# Altium schematic sheet Lesson_03.SchDoc
size A4
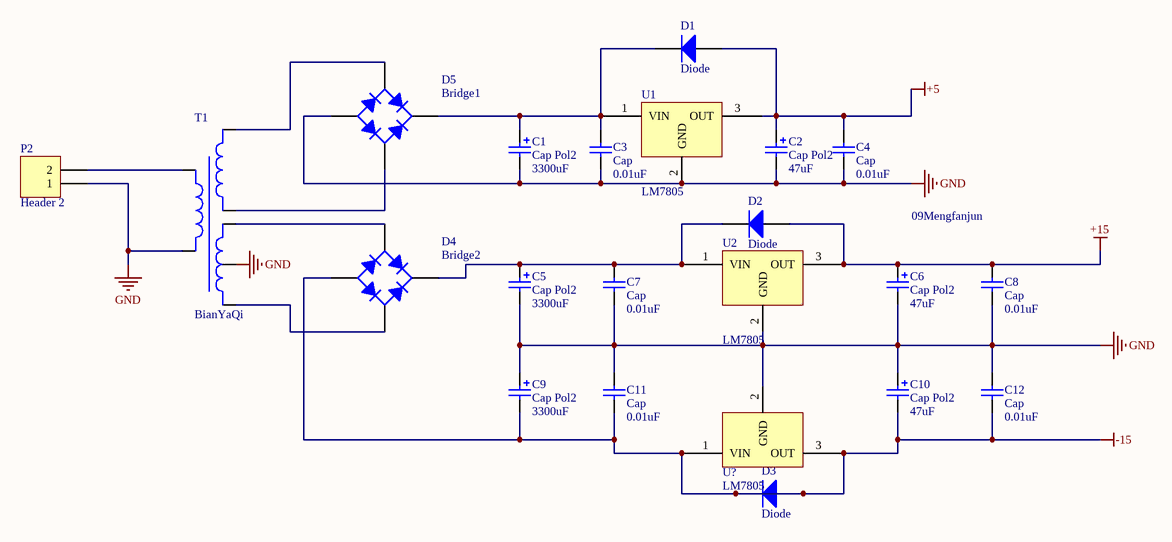
[diagram p0: Lesson_03.SchDoc]

## Parts
C1  Cap Pol2  value 3300uF  [POLAR0.8]
C2  Cap Pol2  value 47uF  [POLAR0.8]
C3  Cap  value 0.01uF  [RAD-0.3]
C4  Cap  value 0.01uF  [RAD-0.3]
C5  Cap Pol2  value 3300uF  [POLAR0.8]
C6  Cap Pol2  value 47uF  [POLAR0.8]
C7  Cap  value 0.01uF  [RAD-0.3]
C8  Cap  value 0.01uF  [RAD-0.3]
C9  Cap Pol2  value 3300uF  [POLAR0.8]
C10  Cap Pol2  value 47uF  [POLAR0.8]
C11  Cap  value 0.01uF  [RAD-0.3]
C12  Cap  value 0.01uF  [RAD-0.3]
D1  Diode  [SMC]
D2  Diode  [SMC]
D3  Diode  [SMC]
D4  Bridge2  [D-38]
D5  Bridge1  [D-38]
P2  Header 2  [HDR1X2]
T1  BianYaQi
U1  LM7805
U2  LM7805
U?  LM7805

## Nets
+5: C2.1 C4.2 D1.1(A) U1.3(OUT)
+15: C6.1 C8.2 D2.1(A) U2.3(OUT)
-15: C9.2 C10.2 C11.1 C12.1 D3.1(A) D3.2(K) D4.3(A) U?.1(VIN) U?.3(OUT)
GND: C1.2 C2.2 C3.1 C4.1 C5.2 C6.2 C7.1 C8.1 C9.1 C10.1 C11.2 C12.2 D5.3(A) P2.1 T1.2(Pri-) T1.6 U1.2(GND) U2.2(GND) U?.2(GND)
NetC1_1: C1.1 C3.2 D1.2(K) D5.1(K) U1.1(VIN)
NetC5_1: C5.1 C7.2 D2.2(K) D4.1(K) U2.1(VIN)
NetD4_2: D4.2(C) T1.7(Sec2-)
NetD4_4: D4.4(C) T1.5(Sec2+)
NetD5_2: D5.2(C) T1.4(Sec1-)
NetD5_4: D5.4(C) T1.3(Sec1+)
NetP2_2: P2.2 T1.1(Pri+)

## Notes on the sheet
- 09Mengfanjun

## Library data of the parts
C1 C2 C5 C6 C9 C10 = Cap Pol2: Polarized Capacitor (Axial); Published: 8-Jun-2000; LatestRevisionDate: 17-Jul-2002; LatestRevisionNote: Re-released for DXP Platform.; PackageReference: POLAR0.8; Publisher: Altium Limited; PackageDescription: Polarized Capacitor; 2 Leads
C3 C4 C7 C8 C11 C12 = Cap: Capacitor; Published: 8-Jun-2000; LatestRevisionDate: 17-Jul-2002; LatestRevisionNote: Re-released for DXP Platform.; PackageReference: RAD-0.3; Publisher: Altium Limited; PackageDescription: Radial Cap, Thru-Hole; 2 Leads; 0.3 in Pin Spacing
D1-D3 = Diode: Default Diode; Published: 8-Jun-2000; LatestRevisionDate: 17-Jul-2002; LatestRevisionNote: Re-released for DXP Platform.; PackageVersion: Sep-1996; PackageReference: SMC; Publisher: Altium Limited; PackageDescription: DO-214-AB/SMC; 2 C-Bend Leads; Body 7.9 x 5.9 mm, inc. leads (LxW); Code_JEDEC: DO-214-AB
D4 D5 = Bridge1: Full Wave Diode Bridge; Published: 8-Jun-2000; LatestRevisionDate: 29-May-2009; LatestRevisionNote: Sch pins A & K swapped.; DatasheetVersion: E2732B; PackageReference: D-38; Publisher: Altium Limited; PackageDescription: Bridge Rectifier; 4 Terminals; Body 9.4 x 9.4 mm (typ); Pitch 5.08 mm
P2 = Header 2: Header, 2-Pin; LatestRevisionDate: 17-Jul-2002; LatestRevisionNote: Re-released for DXP Platform.; Publisher: Altium Limited